# Altium schematic sheet d-phy_block.SchDoc
size A4
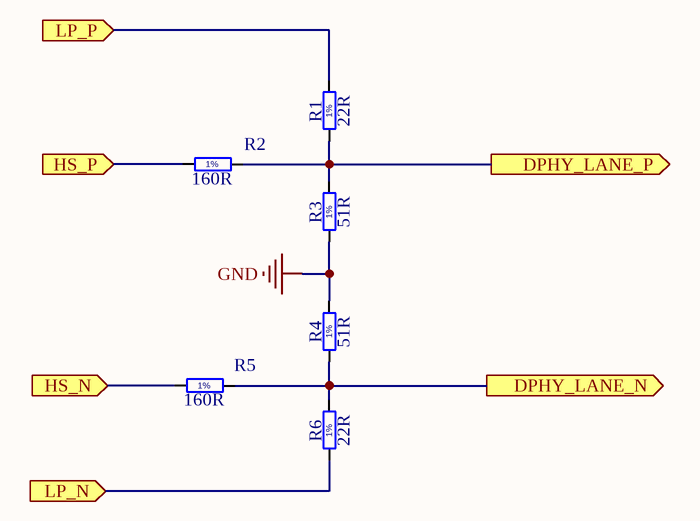
[diagram p0: d-phy_block.SchDoc]

## Parts
R1  22R  [RESC1608X55N]
R2  160R  [RESC1608X55N]
R3  51R  [RESC1608X55N]
R4  51R  [RESC1608X55N]
R5  160R  [RESC1608X55N]
R6  22R  [RESC1608X55N]

## Ports
DPHY_LANE_N (out), DPHY_LANE_P (out), HS_N (in), HS_P (in), LP_N (in), LP_P (in)

## Nets
GND: R3.1 R4.2
DPHY_LANE_N: R4.1 R5.2 R6.2 ; port DPHY_LANE_N
DPHY_LANE_P: R1.1 R2.2 R3.2 ; port DPHY_LANE_P
HS_N: R5.1 ; port HS_N
HS_P: R2.1 ; port HS_P
LP_N: R6.1 ; port LP_N
LP_P: R1.2 ; port LP_P

## Notes on the sheet
- (in symbol R0603_100K_1%_0.1W_100PPM) 1%

## Library data of the parts
R1-R6 = R0603_100K_1%_0.1W_100PPM: Resistor - 1%; Part Description: General Purpose Thick Film Chip Resistor; Manufacturer: GENERIC; Manufacturer1 Part Number: NRC06F1003TRF; Value: 100k; Power: 0.1W; TC: ±100ppm/°C; PressFit: No; Part Number: R0603_100K_1%_0.1W_100PPM; Component Kind: Standard; Component Type: Standard; Pin Count: 2; Status: Preferred; Tolerance: ±1%; Manufacturer Part Number: R0603_100K_1%_0.1W_100PPM; Case: 0603; Mounted: Yes; Sense: No; Socket: No; SMD: Yes; Manufacturer1 Example: NIC COMPONENT; Manufacturer1 ComponentHeight: 0.55mm; HelpURL: \\cern.ch\dfs\Applications\Altium\Datasheets\R0603_NIC_NRC.pdf; Author: CERN DEM JLC; CreateDate: 03.12.2007; LatestRevisionDate: 13.03.2008